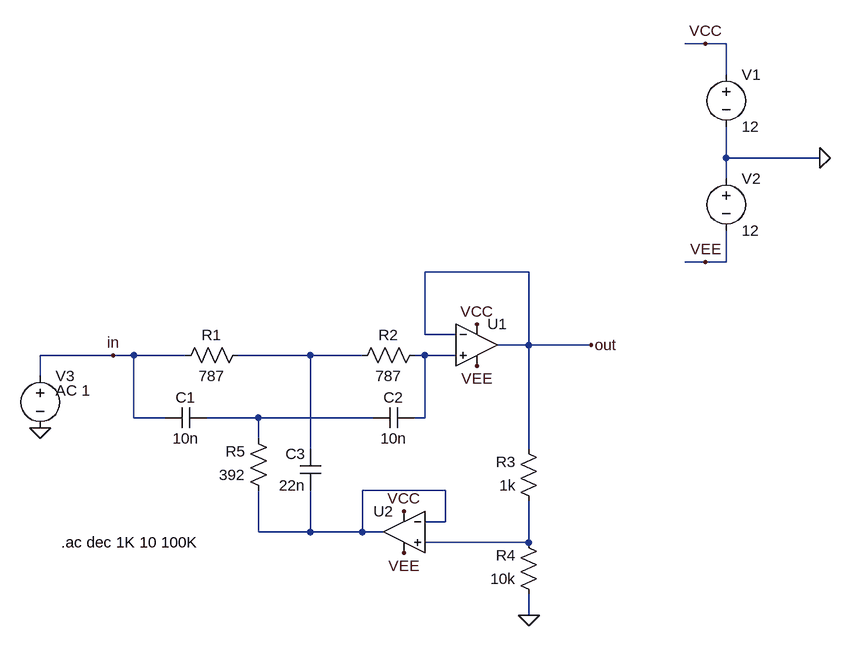
[diagram p0: schematic TwinTNotch.asc]
TwinTNotch.asc, the LTspice schematic file:
Version 4
SHEET 1 1216 680
WIRE 1024 -240 992 -240
WIRE 1056 -240 1024 -240
WIRE 1056 -192 1056 -240
WIRE 1056 -64 1056 -112
WIRE 1200 -64 1056 -64
WIRE 1056 -32 1056 -64
WIRE 1024 96 992 96
WIRE 1056 96 1056 48
WIRE 1056 96 1024 96
WIRE 752 112 592 112
WIRE 592 208 592 112
WIRE 640 208 592 208
WIRE 752 224 752 112
WIRE 752 224 704 224
WIRE 848 224 752 224
WIRE 112 240 0 240
WIRE 144 240 112 240
WIRE 224 240 144 240
WIRE 416 240 304 240
WIRE 496 240 416 240
WIRE 592 240 576 240
WIRE 640 240 592 240
WIRE 0 272 0 240
WIRE 144 336 144 240
WIRE 192 336 144 336
WIRE 336 336 256 336
WIRE 512 336 336 336
WIRE 592 336 592 240
WIRE 592 336 576 336
WIRE 336 368 336 336
WIRE 416 384 416 240
WIRE 752 384 752 224
WIRE 624 448 496 448
WIRE 624 496 624 448
WIRE 624 496 592 496
WIRE 336 512 336 448
WIRE 416 512 416 448
WIRE 416 512 336 512
WIRE 496 512 496 448
WIRE 496 512 416 512
WIRE 528 512 496 512
WIRE 752 528 752 464
WIRE 752 528 592 528
WIRE 752 640 752 608
FLAG 1024 96 VEE
FLAG 1200 -64 0
FLAG 1024 -240 VCC
FLAG 672 192 VCC
FLAG 560 480 VCC
FLAG 560 544 VEE
FLAG 672 256 VEE
FLAG 752 640 0
FLAG 112 240 in
FLAG 848 224 out
FLAG 0 352 0
SYMBOL res 320 224 R90
WINDOW 0 0 56 VBottom 2
WINDOW 3 32 56 VTop 2
SYMATTR InstName R1
SYMATTR Value 787
SYMBOL res 592 224 R90
WINDOW 0 0 56 VBottom 2
WINDOW 3 32 56 VTop 2
SYMATTR InstName R2
SYMATTR Value 787
SYMBOL res 768 480 R180
WINDOW 0 36 76 Left 2
WINDOW 3 36 40 Left 2
SYMATTR InstName R3
SYMATTR Value 1k
SYMBOL res 768 624 R180
WINDOW 0 36 76 Left 2
WINDOW 3 36 40 Left 2
SYMATTR InstName R4
SYMATTR Value 10k
SYMBOL res 352 464 R180
WINDOW 0 36 76 Left 2
WINDOW 3 36 40 Left 2
SYMATTR InstName R5
SYMATTR Value 392
SYMBOL cap 256 320 R90
WINDOW 0 0 32 VBottom 2
WINDOW 3 32 32 VTop 2
SYMATTR InstName C1
SYMATTR Value 10n
SYMBOL cap 576 320 R90
WINDOW 0 0 32 VBottom 2
WINDOW 3 32 32 VTop 2
SYMATTR InstName C2
SYMATTR Value 10n
SYMBOL OpAmps/UniversalOpAmp2 560 512 M0
SYMATTR InstName U2
SYMBOL OpAmps/UniversalOpAmp2 672 224 R0
SYMATTR InstName U1
SYMBOL cap 432 448 R180
WINDOW 0 24 56 Left 2
WINDOW 3 24 8 Left 2
SYMATTR InstName C3
SYMATTR Value 22n
SYMBOL voltage 1056 -208 R0
SYMATTR InstName V1
SYMATTR Value 12
SYMBOL voltage 1056 -48 R0
SYMATTR InstName V2
SYMATTR Value 12
SYMBOL voltage 0 256 R0
WINDOW 123 24 38 Left 2
SYMATTR Value2 AC 1
SYMATTR InstName V3
SYMATTR Value ""
TEXT 32 528 Left 2 !.ac dec 1K 10 100K

The netlist it stands for:
* TwinTNotch.asc
R1 N001 in 787
R2 N002 N001 787
R3 N005 out 1k
R4 0 N005 10k
R5 N004 N003 392
C1 N003 in 10n
C2 N002 N003 10n
XU2 N005 N004 VCC VEE N004 level2 Avol=1Meg GBW=10Meg Slew=10Meg Ilimit=25m Rail=0 Vos=0 En=0 Enk=0 In=0 Ink=0 Rin=500Meg  ; pins In+ In- V+ V- OUT
XU1 N002 out VCC VEE out level2 Avol=1Meg GBW=10Meg Slew=10Meg Ilimit=25m Rail=0 Vos=0 En=0 Enk=0 In=0 Ink=0 Rin=500Meg  ; pins In+ In- V+ V- OUT
C3 N004 N001 22n
V1 VCC 0 12
V2 0 VEE 12
V3 in 0 AC 1
.ac dec 1K 10 100K
.lib UniversalOpAmp2.lib
.backanno
.end